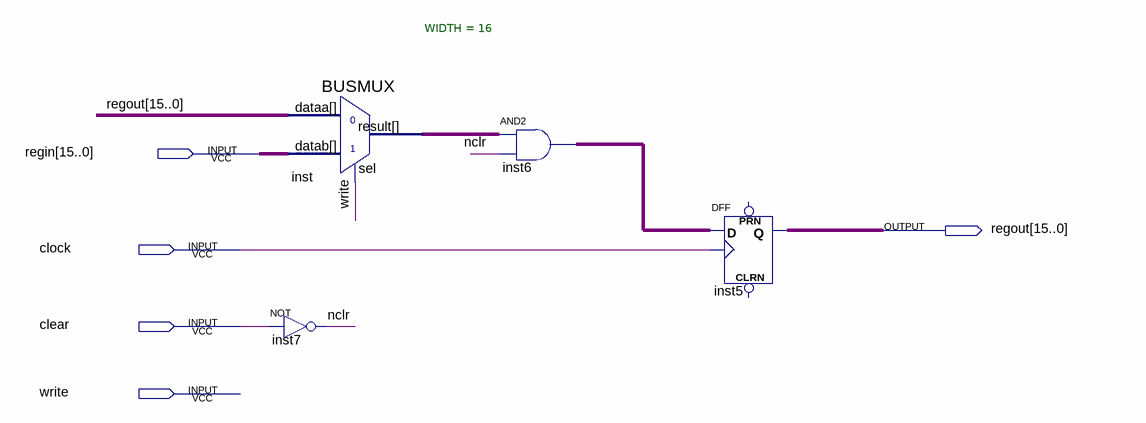
[diagram p0: schematic sheet]
// Quartus schematic Register16.bdf as structural Verilog: 4 symbols, 5 pins
module Register16 (
  input  [15:0] regin,
  input  clock,
  input  clear,
  input  write,
  output [15:0] regout
);

  wire nclr;
  wire [15:0] inst6_out, inst_result;

  not inst7 (nclr, clear);
  BUSMUX #(.WIDTH(16)) inst (.datab(regin), .sel(write), .dataa(regout), .result(inst_result));
  assign inst6_out = inst_result & {16{nclr}};  // AND2 inst6, 16 bits wide
  DFF inst5[15:0] (.CLK(clock), .D(inst6_out), .Q(regout));  // open: CLRN, PRN
endmodule
